# Altium schematic sheet BlockDiagram.SchDoc
size A4; SheetNumber: 1; SheetTotal: 4
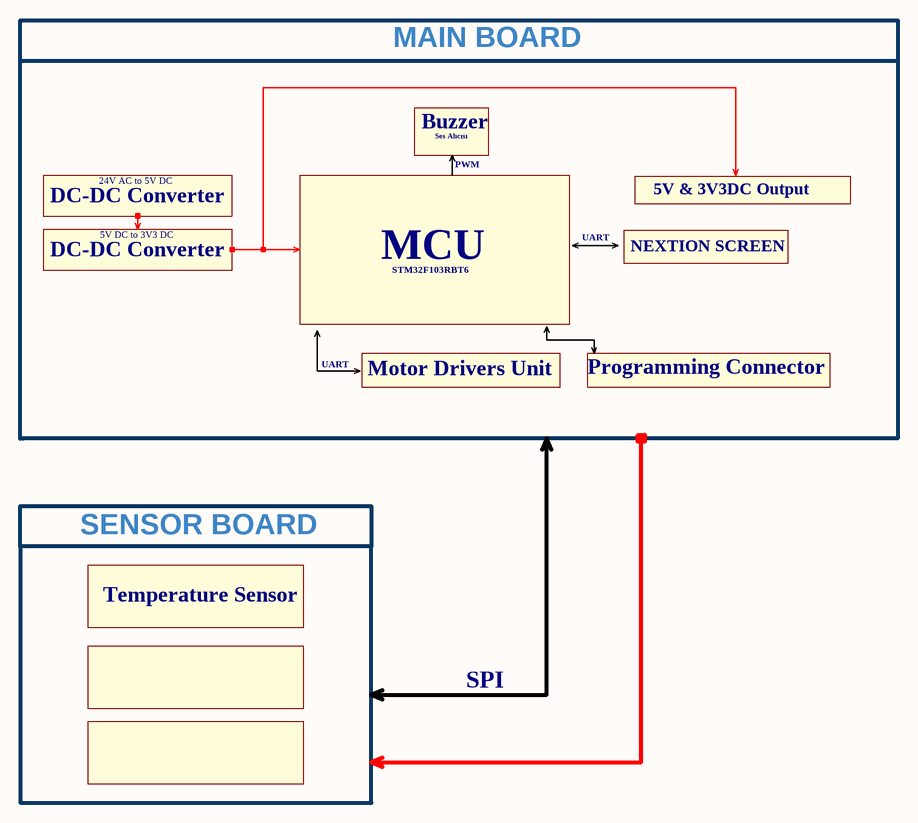
[diagram p0: BlockDiagram.SchDoc]

## Notes on the sheet
- MAIN BOARD
- Buzzer
- 24V AC to 5V DC
- Ses Alıcısı
- PWM
- 5V & 3V3DC Output
- DC-DC Converter
- 5V DC to 3V3 DC
- MCU
- UART
- NEXTION SCREEN
- STM32F103RBT6
- Motor Drivers Unit
- Programming Connector
- SENSOR BOARD
- Temperature Sensor
- SPI